# EAGLE schematic breakout (EAGLE 8.4.1)
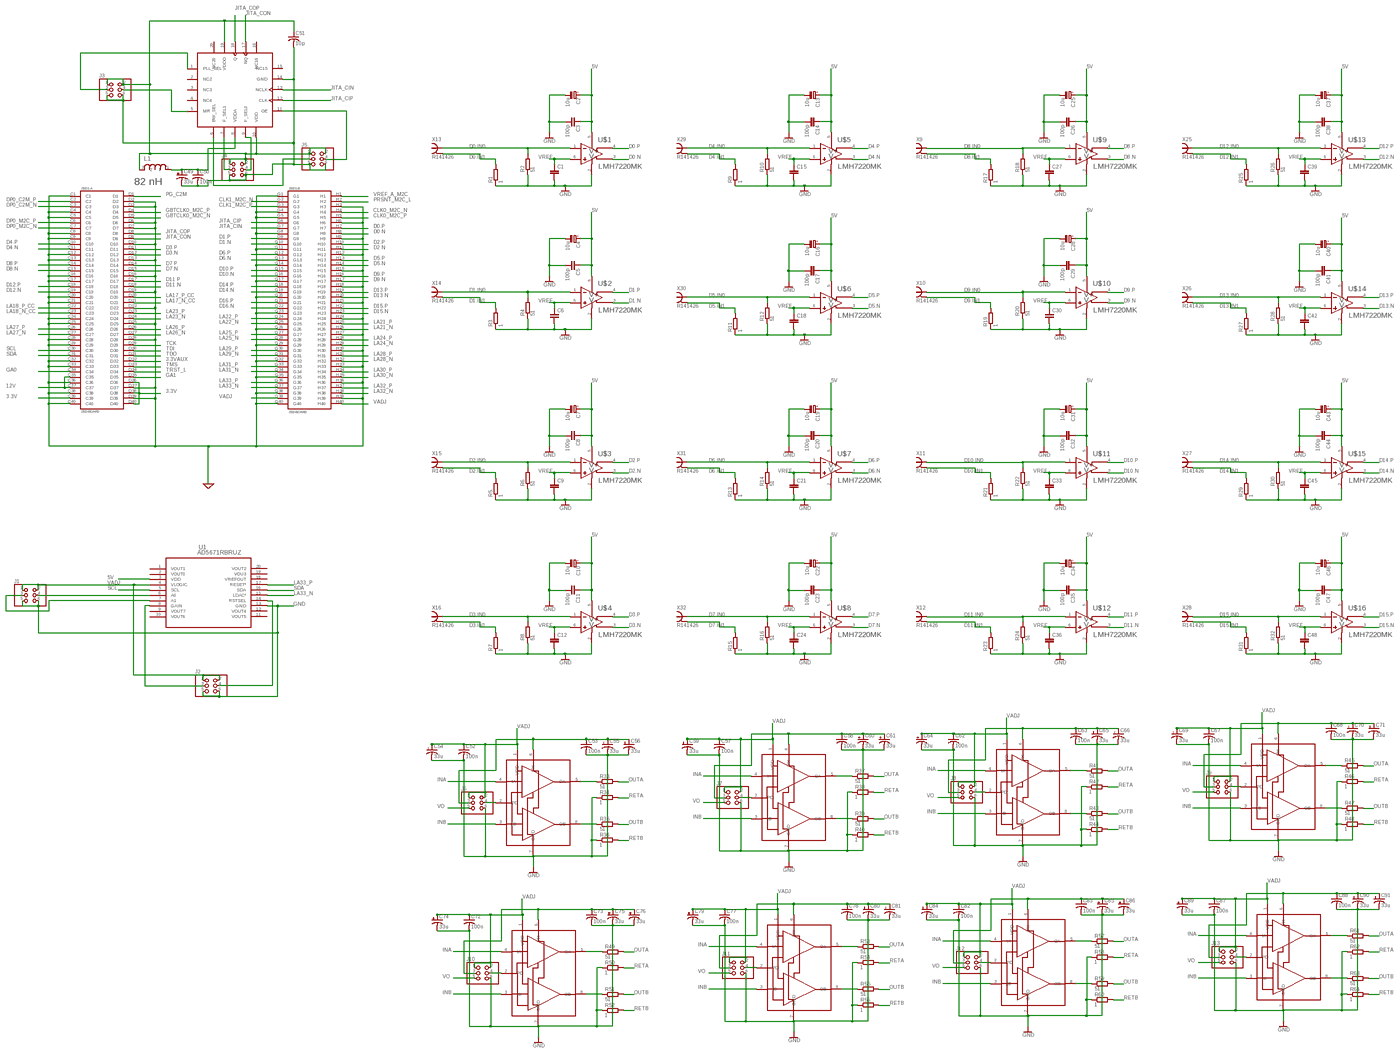
[diagram p0: schematic, sheet 1, overview]
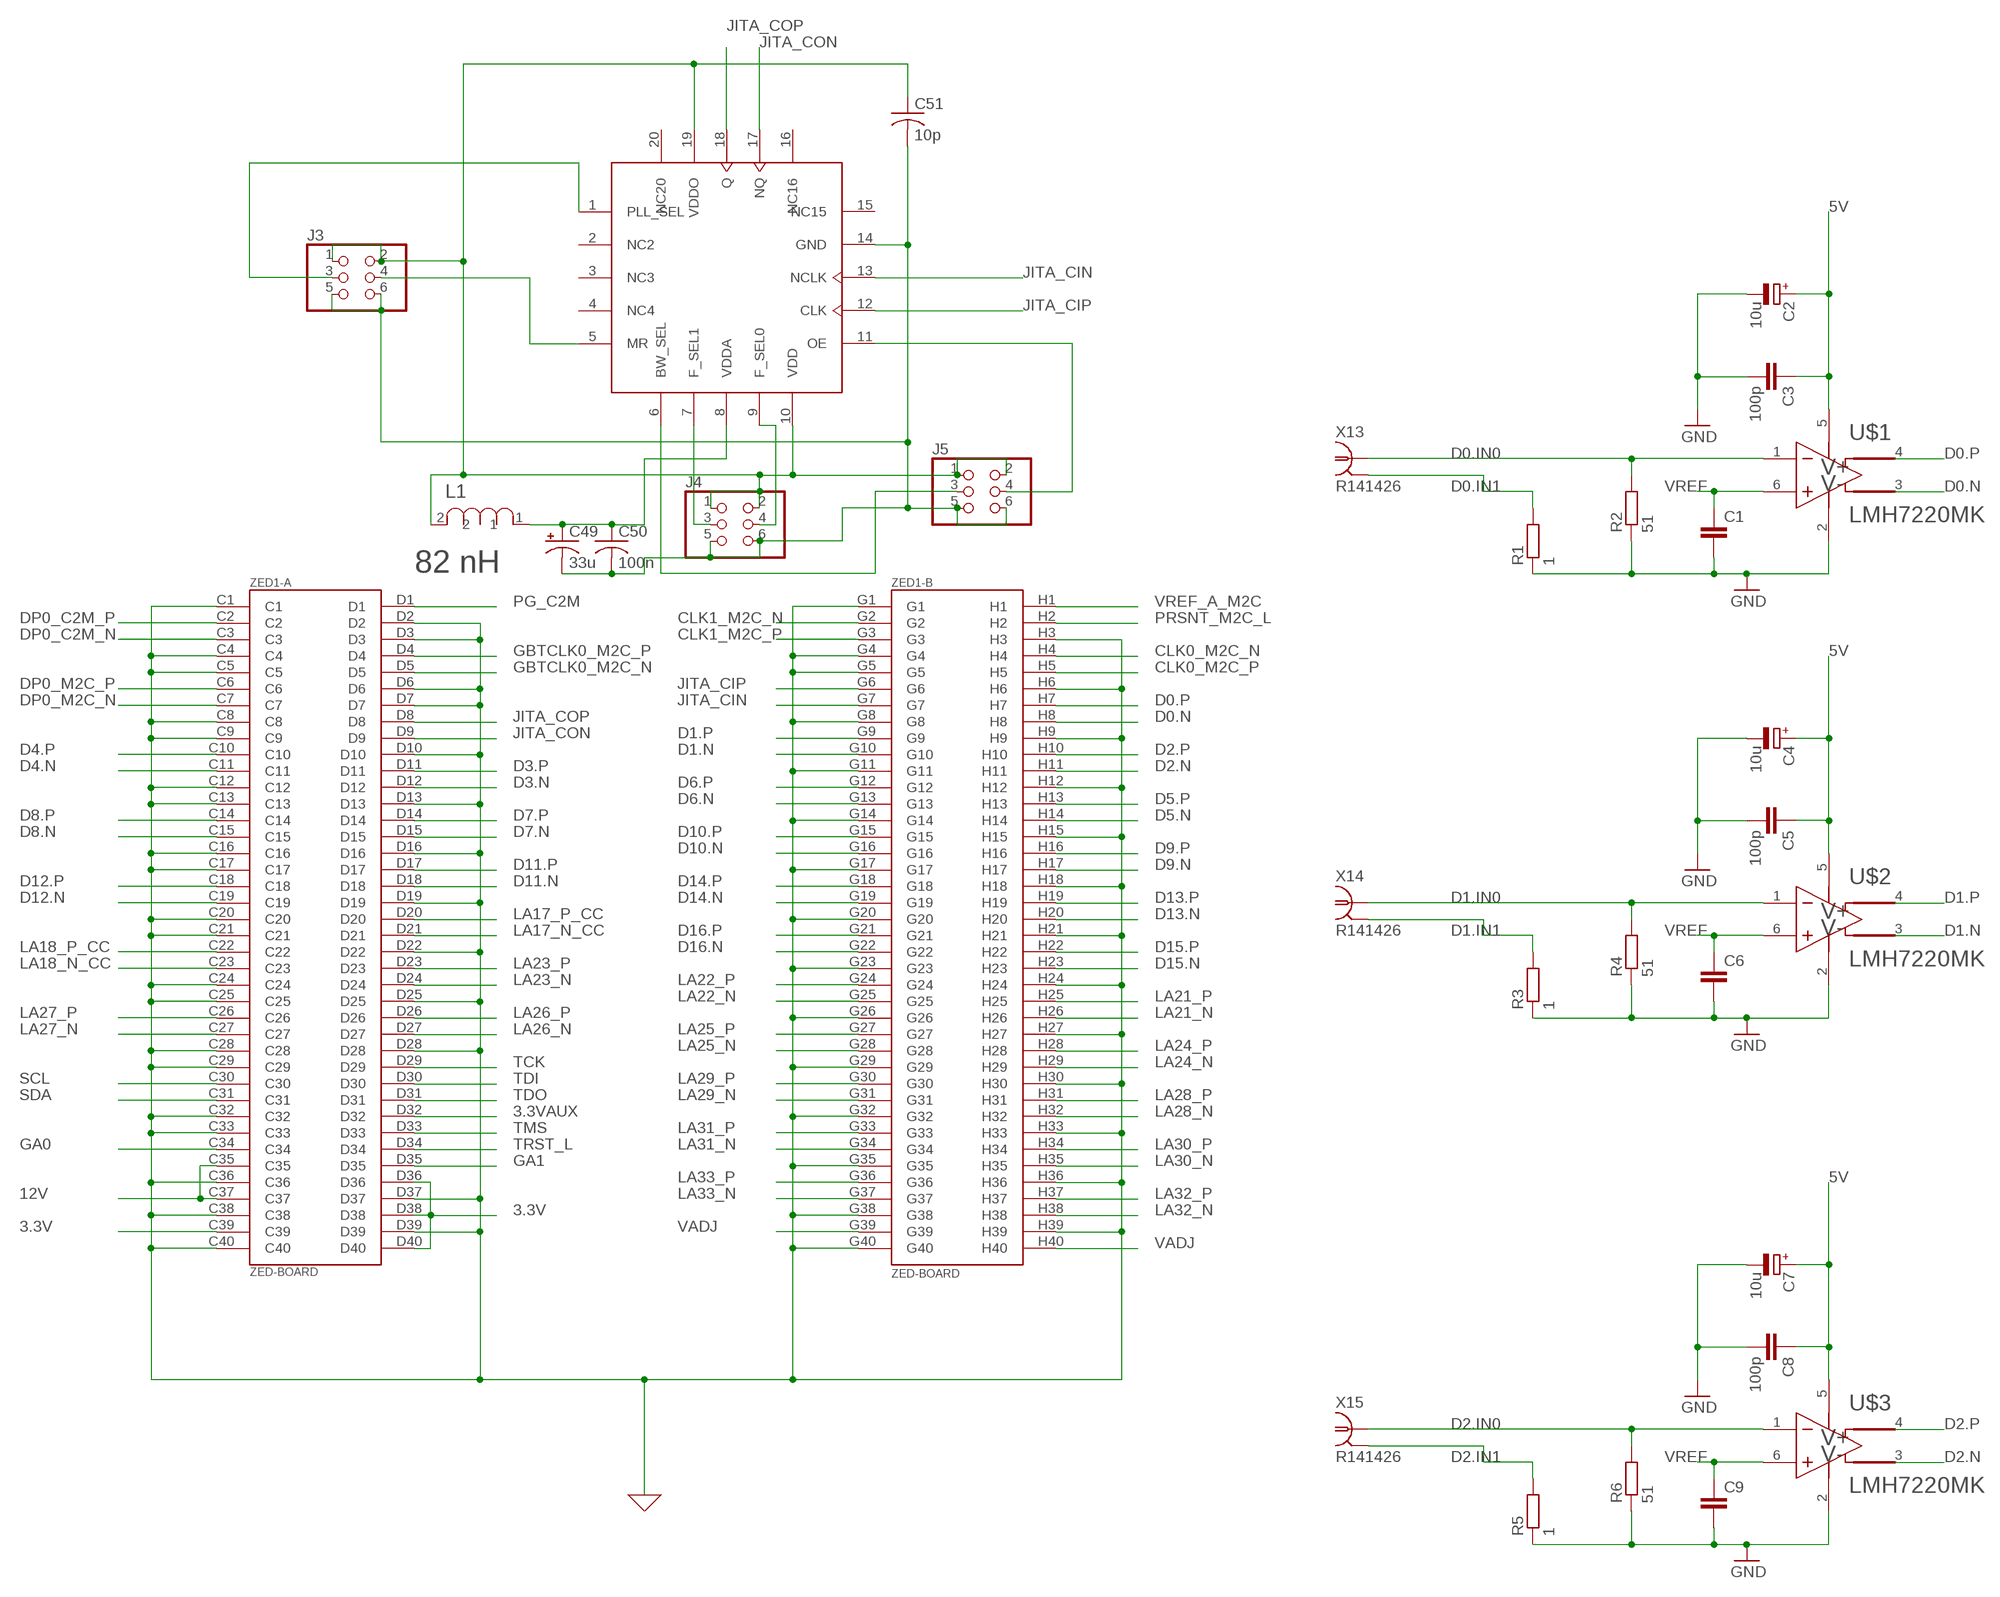
[diagram p1: schematic, sheet 1, part 1 of 4]
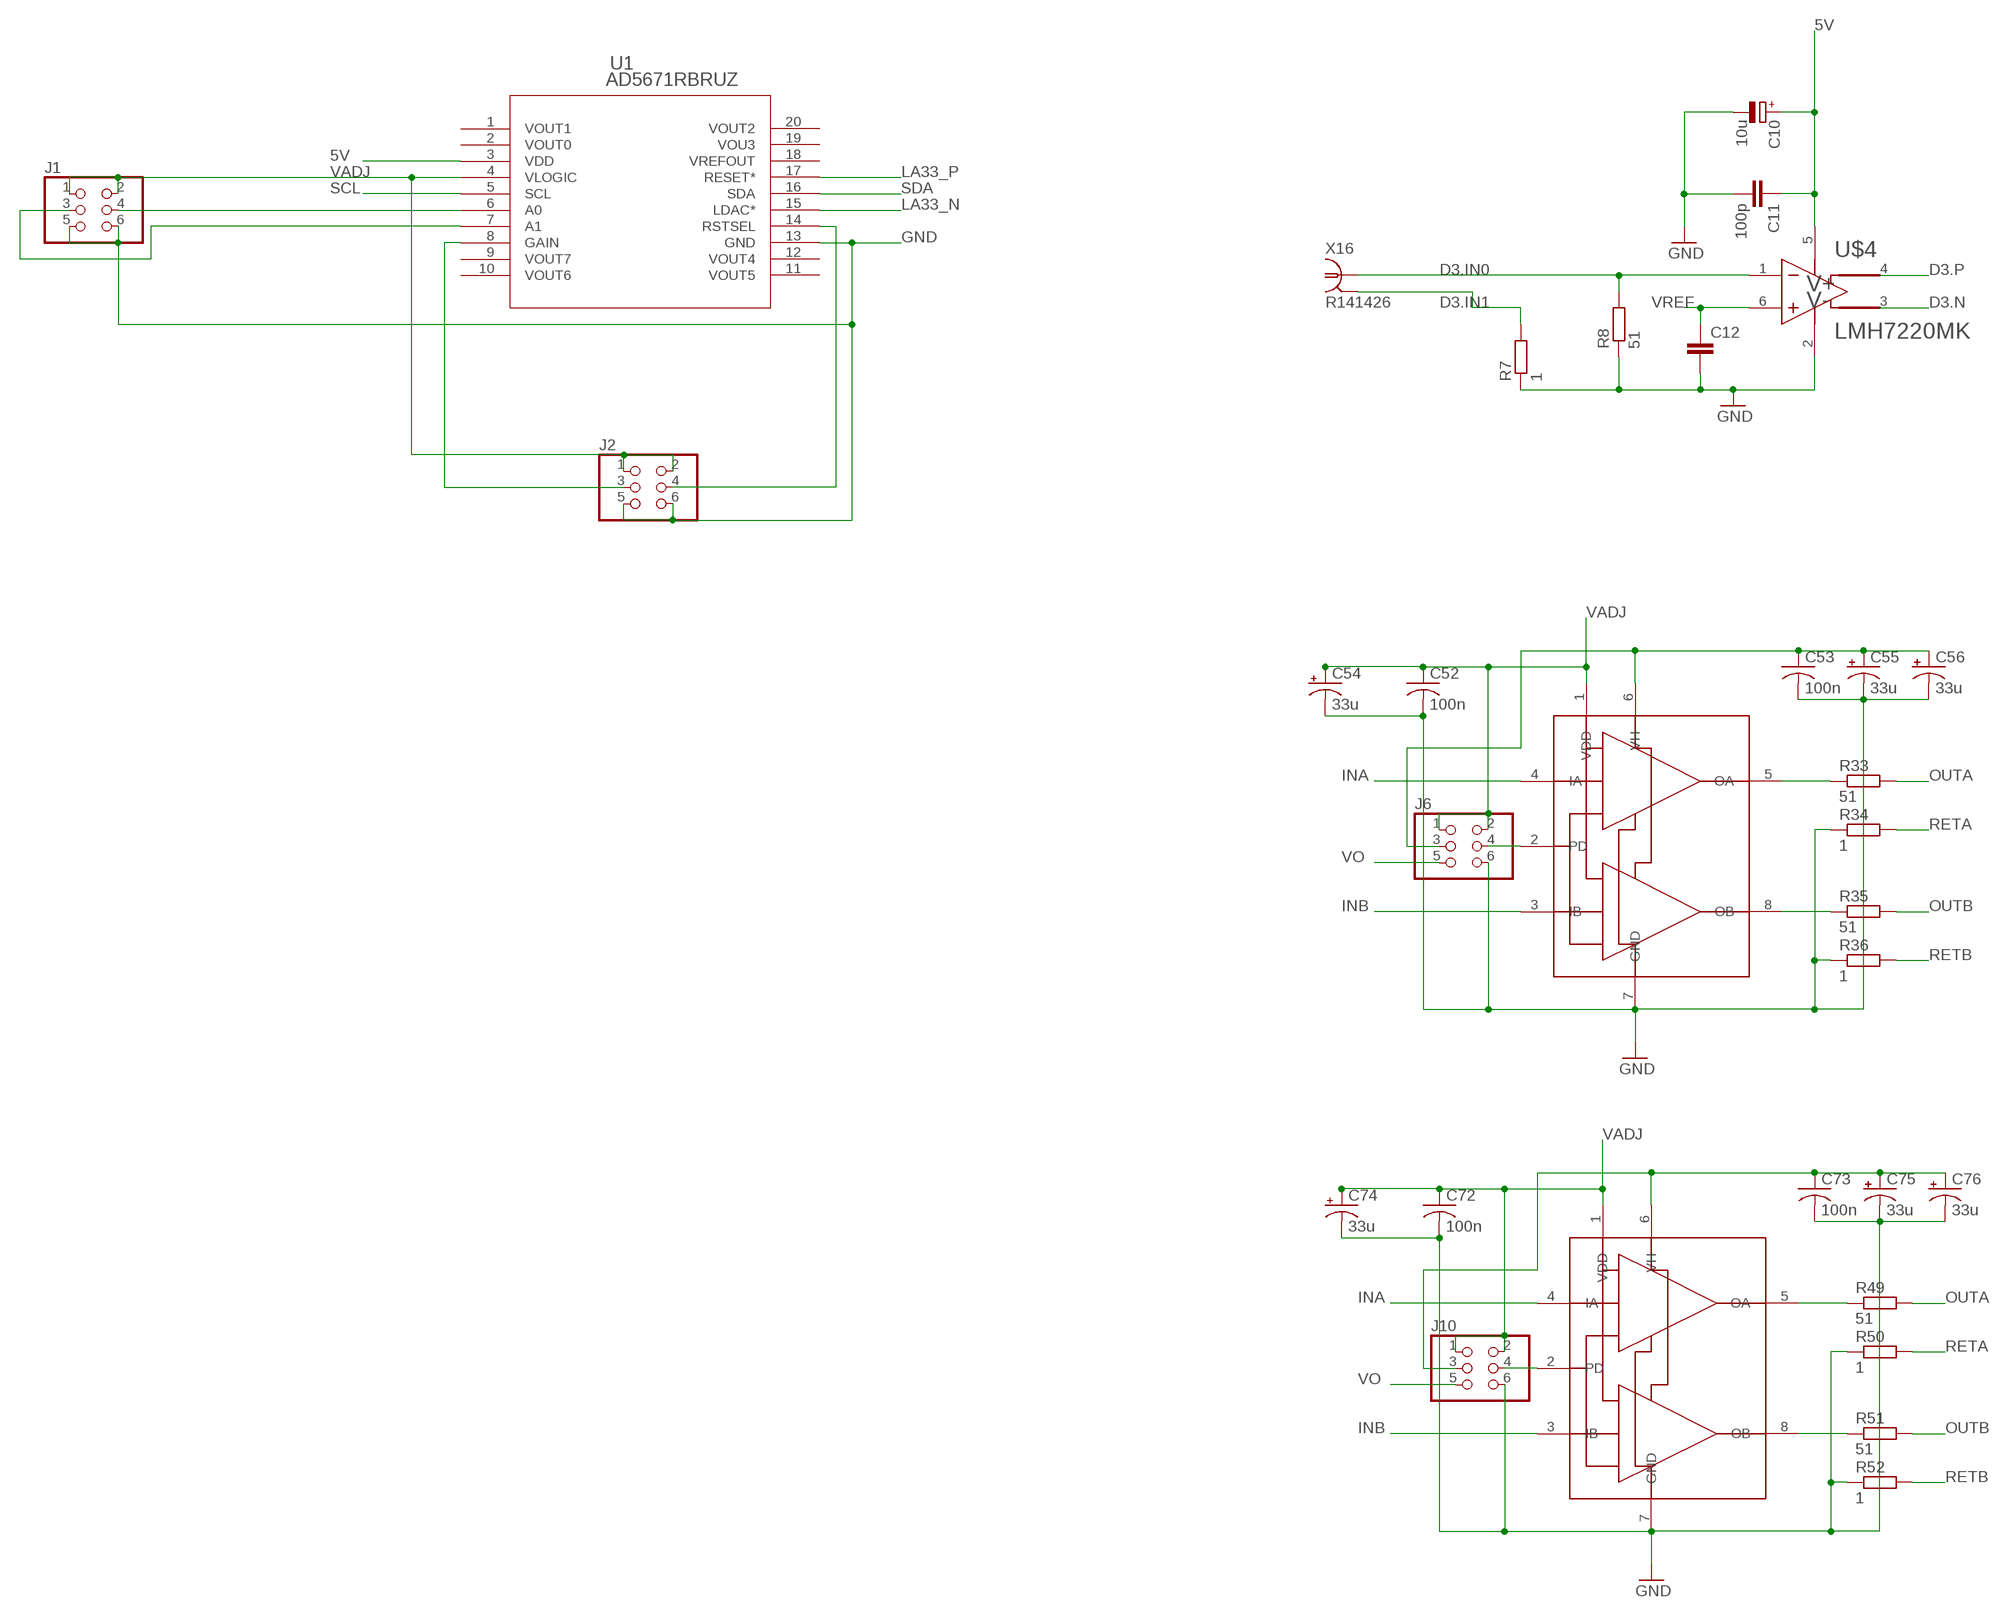
[diagram p2: schematic, sheet 1, part 2 of 4]
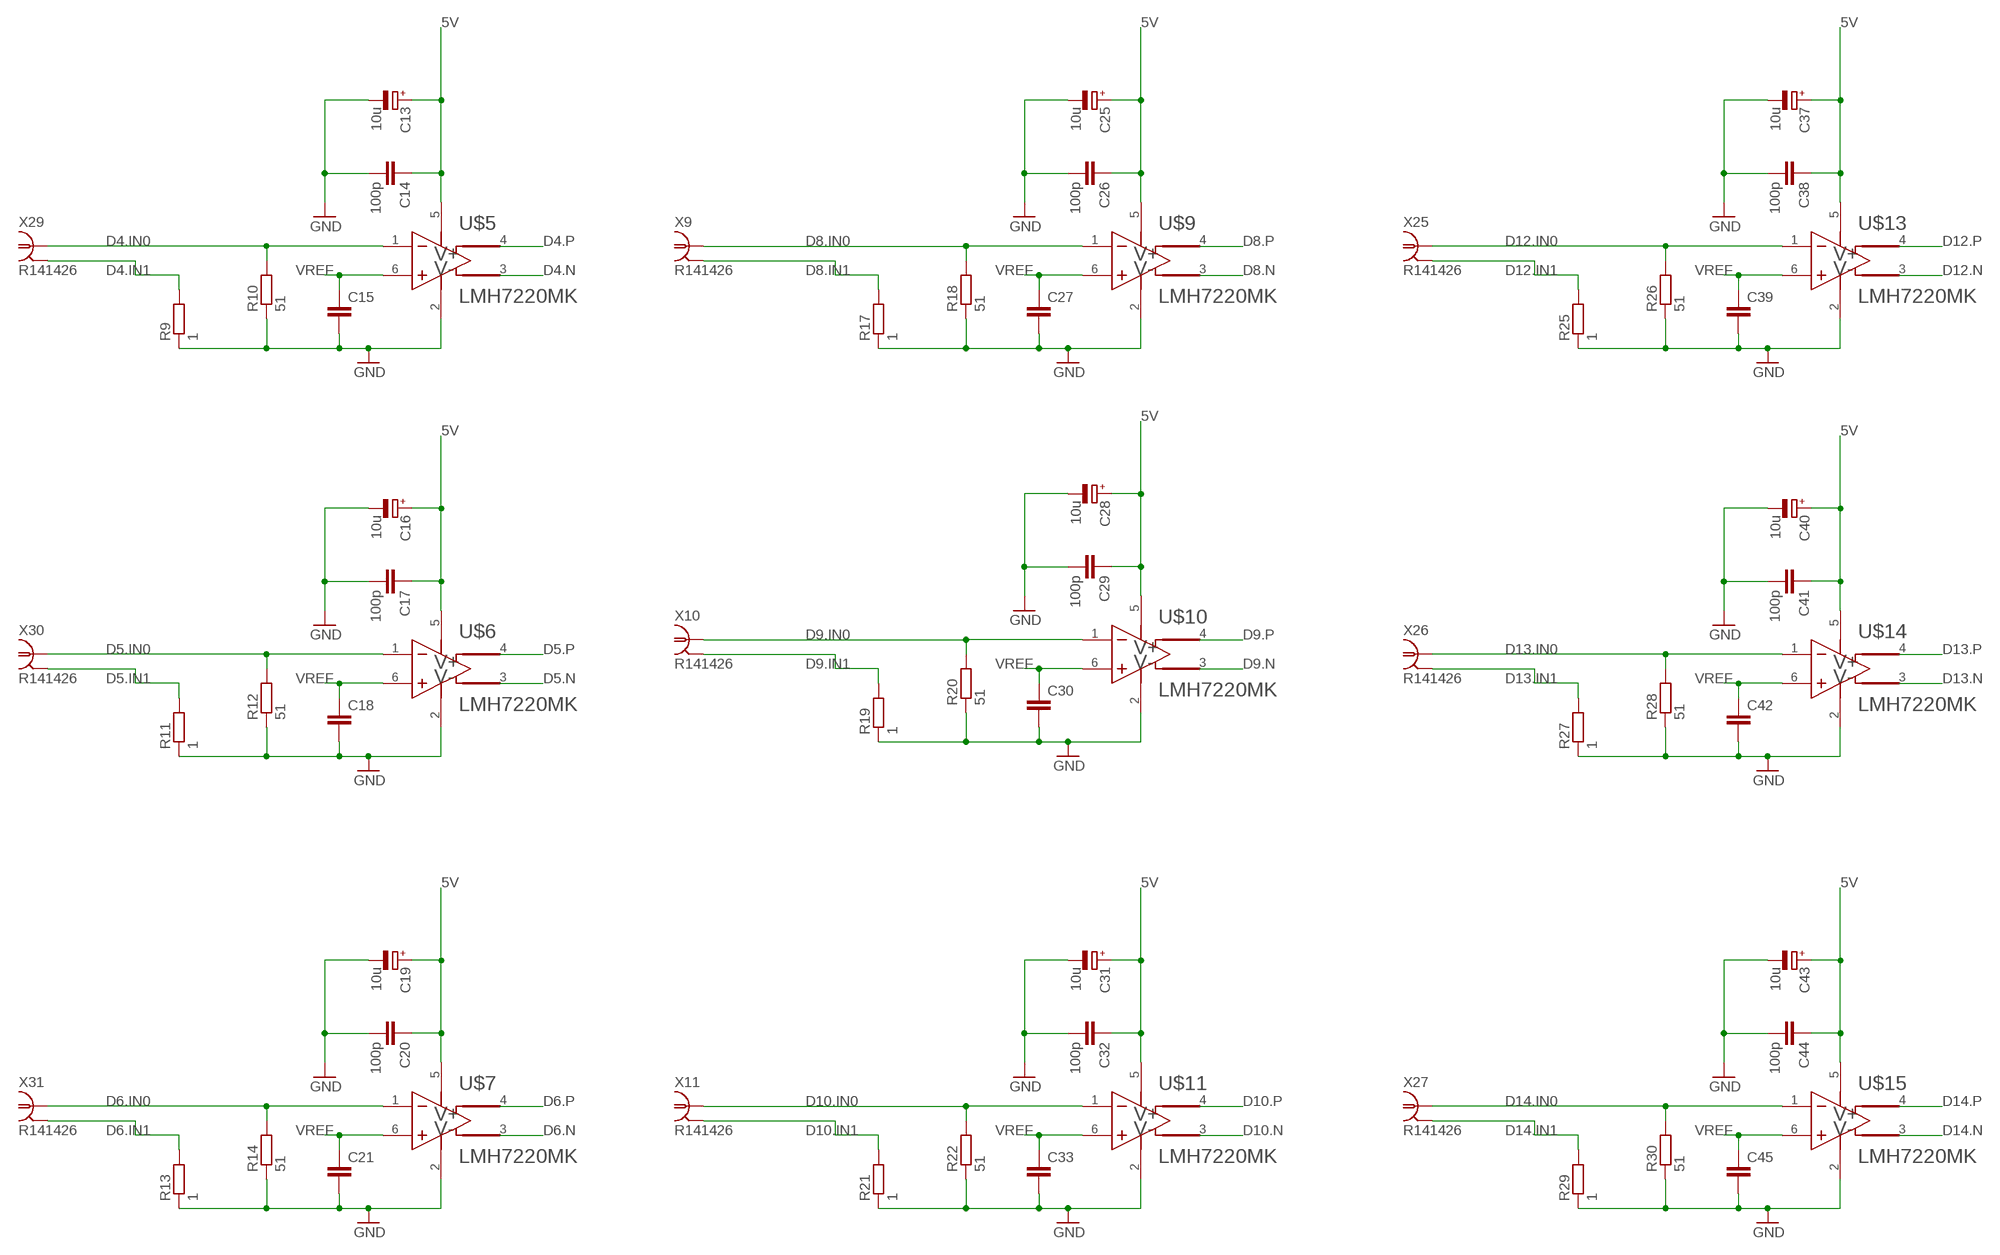
[diagram p3: schematic, sheet 1, part 3 of 4]
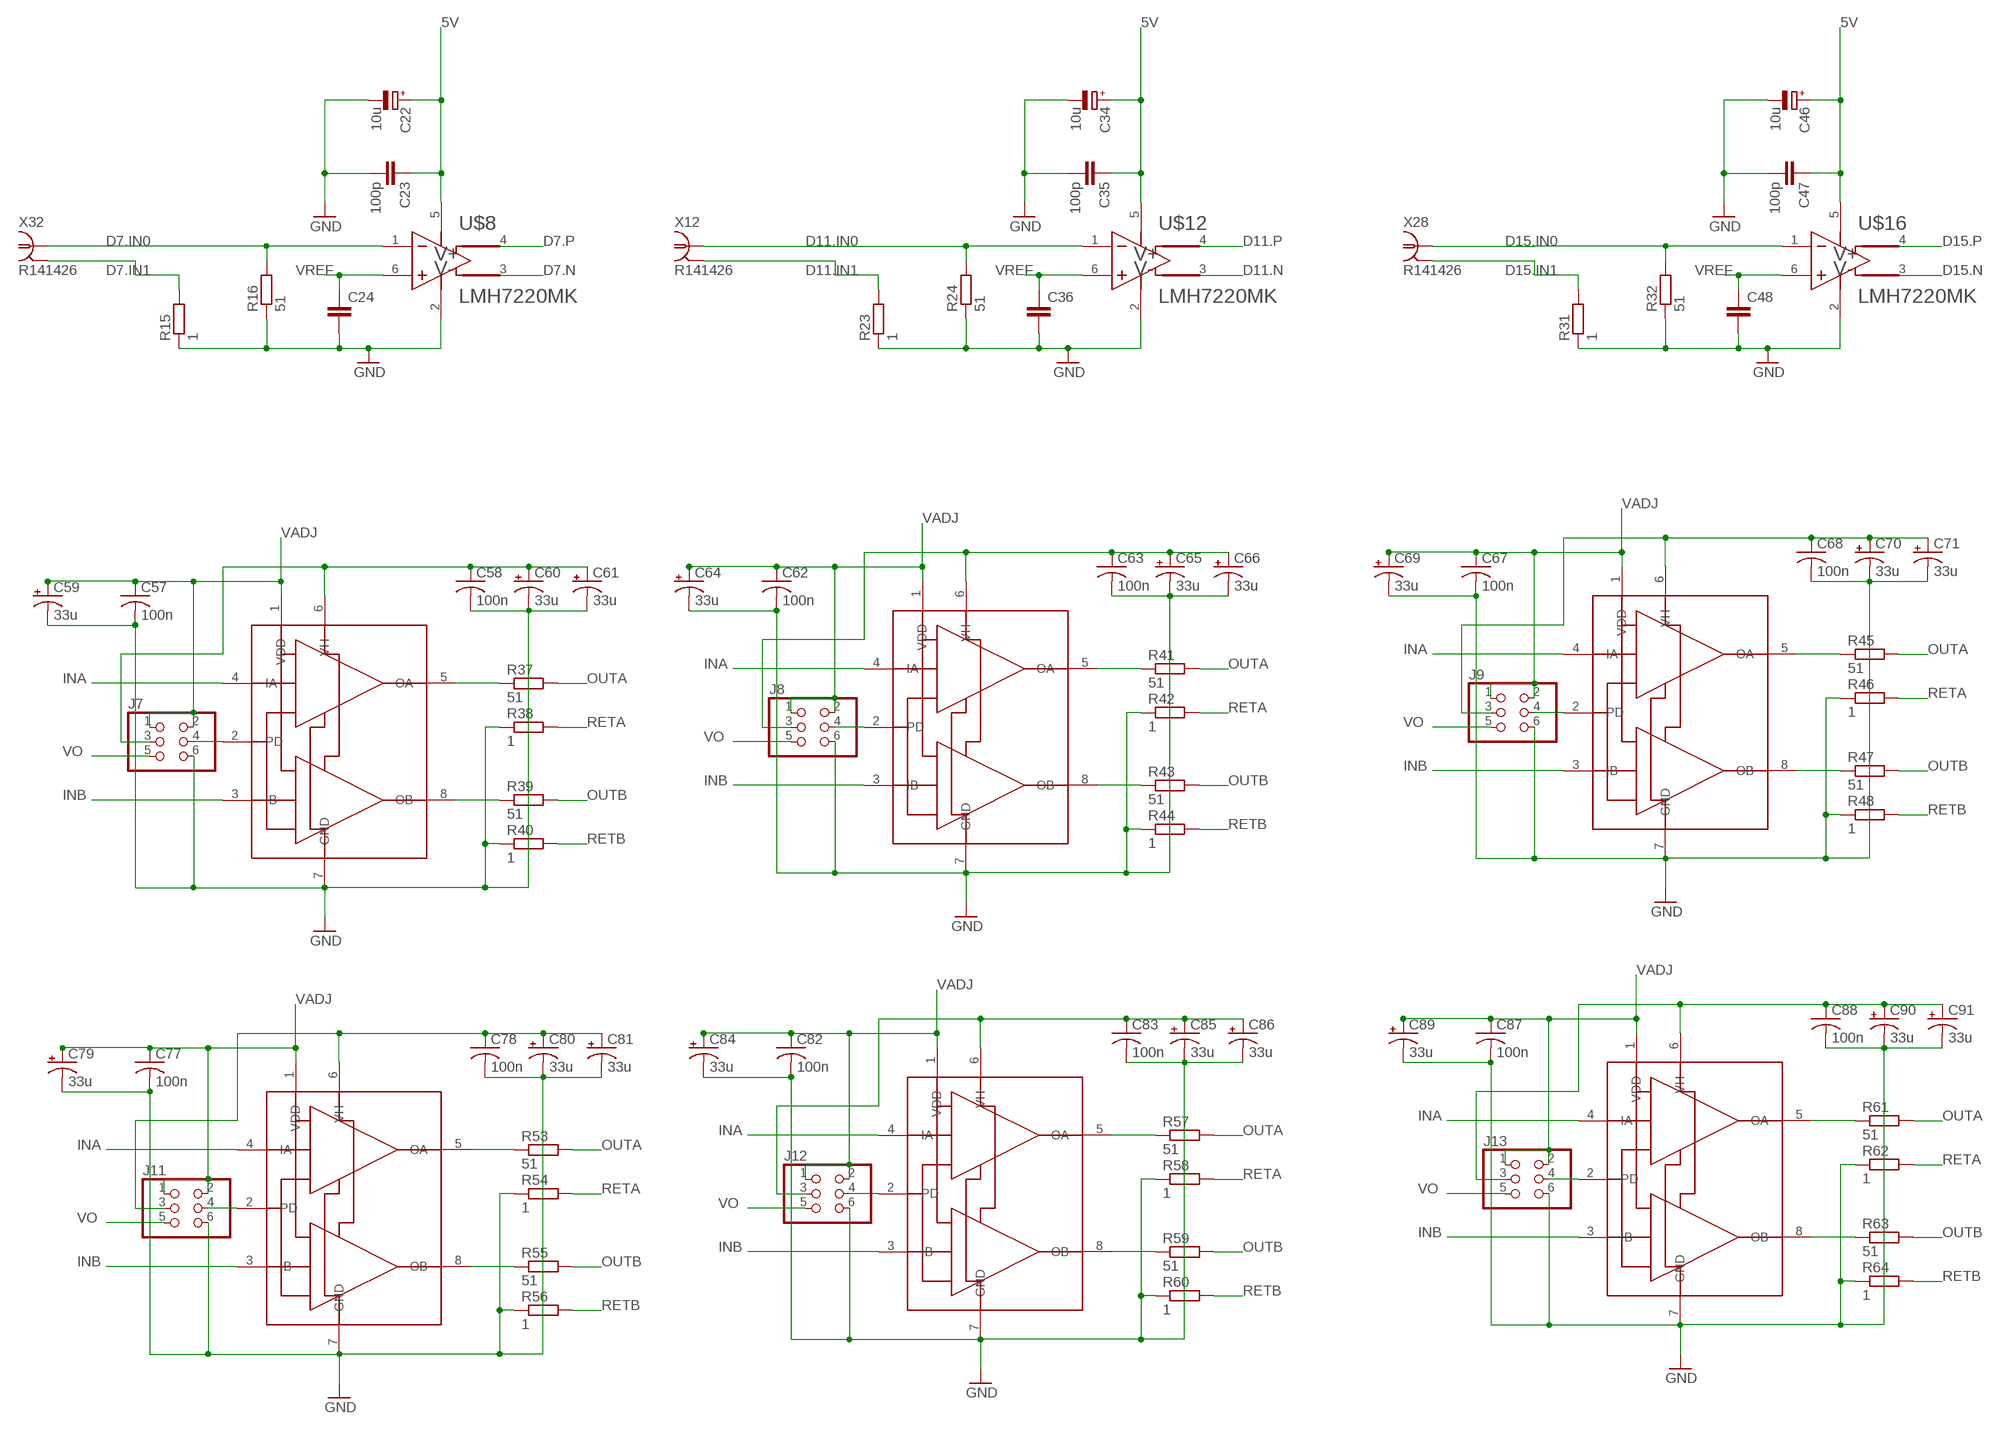
[diagram p4: schematic, sheet 1, part 4 of 4]

## Parts
C1  C-EUC2012  [C2012]
C2  10u  CPOL-EUCT3528  [CT3528]
C3  100p  C-EUC2012  [C2012]
C4  10u  CPOL-EUCT3528  [CT3528]
C5  100p  C-EUC2012  [C2012]
C6  C-EUC2012  [C2012]
C7  10u  CPOL-EUCT3528  [CT3528]
C8  100p  C-EUC2012  [C2012]
C9  C-EUC2012  [C2012]
C10  10u  CPOL-EUCT3528  [CT3528]
C11  100p  C-EUC2012  [C2012]
C12  C-EUC2012  [C2012]
C13  10u  CPOL-EUCT3528  [CT3528]
C14  100p  C-EUC2012  [C2012]
C15  C-EUC2012  [C2012]
C16  10u  CPOL-EUCT3528  [CT3528]
C17  100p  C-EUC2012  [C2012]
C18  C-EUC2012  [C2012]
C19  10u  CPOL-EUCT3528  [CT3528]
C20  100p  C-EUC2012  [C2012]
C21  C-EUC2012  [C2012]
C22  10u  CPOL-EUCT3528  [CT3528]
C23  100p  C-EUC2012  [C2012]
C24  C-EUC2012  [C2012]
C25  10u  CPOL-EUCT3528  [CT3528]
C26  100p  C-EUC2012  [C2012]
C27  C-EUC2012  [C2012]
C28  10u  CPOL-EUCT3528  [CT3528]
C29  100p  C-EUC2012  [C2012]
C30  C-EUC2012  [C2012]
C31  10u  CPOL-EUCT3528  [CT3528]
C32  100p  C-EUC2012  [C2012]
C33  C-EUC2012  [C2012]
C34  10u  CPOL-EUCT3528  [CT3528]
C35  100p  C-EUC2012  [C2012]
C36  C-EUC2012  [C2012]
C37  10u  CPOL-EUCT3528  [CT3528]
C38  100p  C-EUC2012  [C2012]
C39  C-EUC2012  [C2012]
C40  10u  CPOL-EUCT3528  [CT3528]
C41  100p  C-EUC2012  [C2012]
C42  C-EUC2012  [C2012]
C43  10u  CPOL-EUCT3528  [CT3528]
C44  100p  C-EUC2012  [C2012]
C45  C-EUC2012  [C2012]
C46  10u  CPOL-EUCT3528  [CT3528]
C47  100p  C-EUC2012  [C2012]
C48  C-EUC2012  [C2012]
C49  33u  CPOL-USB/3528-21R  [B/3528-21R]
C50  100n  C-USC2012  [C2012]
C51  10p  C-USC2012  [C2012]
C52  100n  C-USC2012  [C2012]
C53  100n  C-USC2012  [C2012]
C54  33u  CPOL-USB/3528-21R  [B/3528-21R]
C55  33u  CPOL-USB/3528-21R  [B/3528-21R]
C56  33u  CPOL-USB/3528-21R  [B/3528-21R]
C57  100n  C-USC2012  [C2012]
C58  100n  C-USC2012  [C2012]
C59  33u  CPOL-USB/3528-21R  [B/3528-21R]
C60  33u  CPOL-USB/3528-21R  [B/3528-21R]
C61  33u  CPOL-USB/3528-21R  [B/3528-21R]
C62  100n  C-USC2012  [C2012]
C63  100n  C-USC2012  [C2012]
C64  33u  CPOL-USB/3528-21R  [B/3528-21R]
C65  33u  CPOL-USB/3528-21R  [B/3528-21R]
C66  33u  CPOL-USB/3528-21R  [B/3528-21R]
C67  100n  C-USC2012  [C2012]
C68  100n  C-USC2012  [C2012]
C69  33u  CPOL-USB/3528-21R  [B/3528-21R]
C70  33u  CPOL-USB/3528-21R  [B/3528-21R]
C71  33u  CPOL-USB/3528-21R  [B/3528-21R]
C72  100n  C-USC2012  [C2012]
C73  100n  C-USC2012  [C2012]
C74  33u  CPOL-USB/3528-21R  [B/3528-21R]
C75  33u  CPOL-USB/3528-21R  [B/3528-21R]
C76  33u  CPOL-USB/3528-21R  [B/3528-21R]
C77  100n  C-USC2012  [C2012]
C78  100n  C-USC2012  [C2012]
C79  33u  CPOL-USB/3528-21R  [B/3528-21R]
C80  33u  CPOL-USB/3528-21R  [B/3528-21R]
C81  33u  CPOL-USB/3528-21R  [B/3528-21R]
C82  100n  C-USC2012  [C2012]
C83  100n  C-USC2012  [C2012]
C84  33u  CPOL-USB/3528-21R  [B/3528-21R]
C85  33u  CPOL-USB/3528-21R  [B/3528-21R]
C86  33u  CPOL-USB/3528-21R  [B/3528-21R]
C87  100n  C-USC2012  [C2012]
C88  100n  C-USC2012  [C2012]
C89  33u  CPOL-USB/3528-21R  [B/3528-21R]
C90  33u  CPOL-USB/3528-21R  [B/3528-21R]
C91  33u  CPOL-USB/3528-21R  [B/3528-21R]
J1  PINHD-2X3  [2X03]
J2  PINHD-2X3  [2X03]
J3  PINHD-2X3  [2X03]
J4  PINHD-2X3  [2X03]
J5  PINHD-2X3  [2X03]
J6  PINHD-2X3  [2X03]
J7  PINHD-2X3  [2X03]
J8  PINHD-2X3  [2X03]
J9  PINHD-2X3  [2X03]
J10  PINHD-2X3  [2X03]
J11  PINHD-2X3  [2X03]
J12  PINHD-2X3  [2X03]
J13  PINHD-2X3  [2X03]
L1  82 nH  CI160808-82NJ  [INDC1608X08N]
R1  1  R-EU_R0805  [R0805]
R2  51  R-EU_R0805  [R0805]
R3  1  R-EU_R0805  [R0805]
R4  51  R-EU_R0805  [R0805]
R5  1  R-EU_R0805  [R0805]
R6  51  R-EU_R0805  [R0805]
R7  1  R-EU_R0805  [R0805]
R8  51  R-EU_R0805  [R0805]
R9  1  R-EU_R0805  [R0805]
R10  51  R-EU_R0805  [R0805]
R11  1  R-EU_R0805  [R0805]
R12  51  R-EU_R0805  [R0805]
R13  1  R-EU_R0805  [R0805]
R14  51  R-EU_R0805  [R0805]
R15  1  R-EU_R0805  [R0805]
R16  51  R-EU_R0805  [R0805]
R17  1  R-EU_R0805  [R0805]
R18  51  R-EU_R0805  [R0805]
R19  1  R-EU_R0805  [R0805]
R20  51  R-EU_R0805  [R0805]
R21  1  R-EU_R0805  [R0805]
R22  51  R-EU_R0805  [R0805]
R23  1  R-EU_R0805  [R0805]
R24  51  R-EU_R0805  [R0805]
R25  1  R-EU_R0805  [R0805]
R26  51  R-EU_R0805  [R0805]
R27  1  R-EU_R0805  [R0805]
R28  51  R-EU_R0805  [R0805]
R29  1  R-EU_R0805  [R0805]
R30  51  R-EU_R0805  [R0805]
R31  1  R-EU_R0805  [R0805]
R32  51  R-EU_R0805  [R0805]
R33  51  R-EU_R0805  [R0805]
R34  1  R-EU_R0805  [R0805]
R35  51  R-EU_R0805  [R0805]
R36  1  R-EU_R0805  [R0805]
R37  51  R-EU_R0805  [R0805]
R38  1  R-EU_R0805  [R0805]
R39  51  R-EU_R0805  [R0805]
R40  1  R-EU_R0805  [R0805]
R41  51  R-EU_R0805  [R0805]
R42  1  R-EU_R0805  [R0805]
R43  51  R-EU_R0805  [R0805]
R44  1  R-EU_R0805  [R0805]
R45  51  R-EU_R0805  [R0805]
R46  1  R-EU_R0805  [R0805]
R47  51  R-EU_R0805  [R0805]
R48  1  R-EU_R0805  [R0805]
R49  51  R-EU_R0805  [R0805]
R50  1  R-EU_R0805  [R0805]
R51  51  R-EU_R0805  [R0805]
R52  1  R-EU_R0805  [R0805]
R53  51  R-EU_R0805  [R0805]
R54  1  R-EU_R0805  [R0805]
R55  51  R-EU_R0805  [R0805]
R56  1  R-EU_R0805  [R0805]
R57  51  R-EU_R0805  [R0805]
R58  1  R-EU_R0805  [R0805]
R59  51  R-EU_R0805  [R0805]
R60  1  R-EU_R0805  [R0805]
R61  51  R-EU_R0805  [R0805]
R62  1  R-EU_R0805  [R0805]
R63  51  R-EU_R0805  [R0805]
R64  1  R-EU_R0805  [R0805]
U1  AD5671RBRUZ  [RU_20]
U$1  LMH7220MK  [TSOP-6.PAC]
U$2  LMH7220MK  [TSOP-6.PAC]
U$3  LMH7220MK  [TSOP-6.PAC]
U$4  LMH7220MK  [TSOP-6.PAC]
U$5  LMH7220MK  [TSOP-6.PAC]
U$6  LMH7220MK  [TSOP-6.PAC]
U$7  LMH7220MK  [TSOP-6.PAC]
U$8  LMH7220MK  [TSOP-6.PAC]
U$9  LMH7220MK  [TSOP-6.PAC]
U$10  LMH7220MK  [TSOP-6.PAC]
U$11  LMH7220MK  [TSOP-6.PAC]
U$12  LMH7220MK  [TSOP-6.PAC]
U$13  LMH7220MK  [TSOP-6.PAC]
U$14  LMH7220MK  [TSOP-6.PAC]
U$15  LMH7220MK  [TSOP-6.PAC]
U$16  LMH7220MK  [TSOP-6.PAC]
U$17  ICS874001I-02  [TSSOP20]
U$18  ISL55110  [TSSOP8]
U$19  ISL55110  [TSSOP8]
U$20  ISL55110  [TSSOP8]
U$21  ISL55110  [TSSOP8]
U$22  ISL55110  [TSSOP8]
U$23  ISL55110  [TSSOP8]
U$24  ISL55110  [TSSOP8]
U$25  ISL55110  [TSSOP8]
X9  R141426  [R141426]
X10  R141426  [R141426]
X11  R141426  [R141426]
X12  R141426  [R141426]
X13  R141426  [R141426]
X14  R141426  [R141426]
X15  R141426  [R141426]
X16  R141426  [R141426]
X25  R141426  [R141426]
X26  R141426  [R141426]
X27  R141426  [R141426]
X28  R141426  [R141426]
X29  R141426  [R141426]
X30  R141426  [R141426]
X31  R141426  [R141426]
X32  R141426  [R141426]
ZED1  ZED-BOARD  [ASP-134604-01]

## Nets
0: ZED1.C1(-A:C1) ZED1.C4(-A:C4) ZED1.C5(-A:C5) ZED1.C8(-A:C8) ZED1.C9(-A:C9) ZED1.C12(-A:C12) ZED1.C13(-A:C13) ZED1.C16(-A:C16) ZED1.C17(-A:C17) ZED1.C20(-A:C20) ZED1.C21(-A:C21) ZED1.C24(-A:C24) ZED1.C25(-A:C25) ZED1.C28(-A:C28) ZED1.C29(-A:C29) ZED1.C32(-A:C32) ZED1.C33(-A:C33) ZED1.C36(-A:C36) ZED1.C38(-A:C38) ZED1.C40(-A:C40) ZED1.D2(-A:D2) ZED1.D3(-A:D3) ZED1.D6(-A:D6) ZED1.D7(-A:D7) ZED1.D10(-A:D10) ZED1.D13(-A:D13) ZED1.D16(-A:D16) ZED1.D19(-A:D19) ZED1.D22(-A:D22) ZED1.D25(-A:D25) ZED1.D28(-A:D28) ZED1.D37(-A:D37) ZED1.D39(-A:D39) ZED1.G1(-B:G1) ZED1.G4(-B:G4) ZED1.G5(-B:G5) ZED1.G8(-B:G8) ZED1.G11(-B:G11) ZED1.G14(-B:G14) ZED1.G17(-B:G17) ZED1.G20(-B:G20) ZED1.G23(-B:G23) ZED1.G26(-B:G26) ZED1.G29(-B:G29) ZED1.G32(-B:G32) ZED1.G35(-B:G35) ZED1.G38(-B:G38) ZED1.G40(-B:G40) ZED1.H3(-B:H3) ZED1.H6(-B:H6) ZED1.H9(-B:H9) ZED1.H12(-B:H12) ZED1.H15(-B:H15) ZED1.H18(-B:H18) ZED1.H21(-B:H21) ZED1.H24(-B:H24) ZED1.H27(-B:H27) ZED1.H30(-B:H30) ZED1.H33(-B:H33) ZED1.H36(-B:H36) ZED1.H39(-B:H39) ; supply symbol labelled GND
3.3V: ZED1.C39(-A:C39) ZED1.D36(-A:D36) ZED1.D38(-A:D38) ZED1.D40(-A:D40)
3.3VAUX: ZED1.D32(-A:D32)
5V: C2.+ C3.1 C4.+ C5.1 C7.+ C8.1 C10.+ C11.1 C13.+ C14.1 C16.+ C17.1 C19.+ C20.1 C22.+ C23.1 C25.+ C26.1 C28.+ C29.1 C31.+ C32.1 C34.+ C35.1 C37.+ C38.1 C40.+ C41.1 C43.+ C44.1 C46.+ C47.1 U1.3(VDD) U$1.5(V+) U$2.5(V+) U$3.5(V+) U$4.5(V+) U$5.5(V+) U$6.5(V+) U$7.5(V+) U$8.5(V+) U$9.5(V+) U$10.5(V+) U$11.5(V+) U$12.5(V+) U$13.5(V+) U$14.5(V+) U$15.5(V+) U$16.5(V+)
12V: ZED1.C35(-A:C35) ZED1.C37(-A:C37)
CLK0_M2C_N: ZED1.H4(-B:H4)
CLK0_M2C_P: ZED1.H5(-B:H5)
CLK1_M2C_N: ZED1.G2(-B:G2)
CLK1_M2C_P: ZED1.G3(-B:G3)
D0.IN0: R2.2 U$1.1(-IN) X13.1
D0.IN1: R1.2 X13.2 X13.3 X13.4 X13.5
D0.N: U$1.3(-OUT) ZED1.H8(-B:H8)
D0.P: U$1.4(+OUT) ZED1.H7(-B:H7)
D1.IN0: R4.2 U$2.1(-IN) X14.1
D1.IN1: R3.2 X14.2 X14.3 X14.4 X14.5
D1.N: U$2.3(-OUT) ZED1.G10(-B:G10)
D1.P: U$2.4(+OUT) ZED1.G9(-B:G9)
D2.IN0: R6.2 U$3.1(-IN) X15.1
D2.IN1: R5.2 X15.2 X15.3 X15.4 X15.5
D2.N: U$3.3(-OUT) ZED1.H11(-B:H11)
D2.P: U$3.4(+OUT) ZED1.H10(-B:H10)
D3.IN0: R8.2 U$4.1(-IN) X16.1
D3.IN1: R7.2 X16.2 X16.3 X16.4 X16.5
D3.N: U$4.3(-OUT) ZED1.D12(-A:D12)
D3.P: U$4.4(+OUT) ZED1.D11(-A:D11)
D4.IN0: R10.2 U$5.1(-IN) X29.1
D4.IN1: R9.2 X29.2 X29.3 X29.4 X29.5
D4.N: U$5.3(-OUT) ZED1.C11(-A:C11)
D4.P: U$5.4(+OUT) ZED1.C10(-A:C10)
D5.IN0: R12.2 U$6.1(-IN) X30.1
D5.IN1: R11.2 X30.2 X30.3 X30.4 X30.5
D5.N: U$6.3(-OUT) ZED1.H14(-B:H14)
D5.P: U$6.4(+OUT) ZED1.H13(-B:H13)
D6.IN0: R14.2 U$7.1(-IN) X31.1
D6.IN1: R13.2 X31.2 X31.3 X31.4 X31.5
D6.N: U$7.3(-OUT) ZED1.G13(-B:G13)
D6.P: U$7.4(+OUT) ZED1.G12(-B:G12)
D7.IN0: R16.2 U$8.1(-IN) X32.1
D7.IN1: R15.2 X32.2 X32.3 X32.4 X32.5
D7.N: U$8.3(-OUT) ZED1.D15(-A:D15)
D7.P: U$8.4(+OUT) ZED1.D14(-A:D14)
D8.IN0: R18.2 U$9.1(-IN) X9.1
D8.IN1: R17.2 X9.2 X9.3 X9.4 X9.5
D8.N: U$9.3(-OUT) ZED1.C15(-A:C15)
D8.P: U$9.4(+OUT) ZED1.C14(-A:C14)
D9.IN0: R20.2 U$10.1(-IN) X10.1
D9.IN1: R19.2 X10.2 X10.3 X10.4 X10.5
D9.N: U$10.3(-OUT) ZED1.H17(-B:H17)
D9.P: U$10.4(+OUT) ZED1.H16(-B:H16)
D10.IN0: R22.2 U$11.1(-IN) X11.1
D10.IN1: R21.2 X11.2 X11.3 X11.4 X11.5
D10.N: U$11.3(-OUT) ZED1.G16(-B:G16)
D10.P: U$11.4(+OUT) ZED1.G15(-B:G15)
D11.IN0: R24.2 U$12.1(-IN) X12.1
D11.IN1: R23.2 X12.2 X12.3 X12.4 X12.5
D11.N: U$12.3(-OUT) ZED1.D18(-A:D18)
D11.P: U$12.4(+OUT) ZED1.D17(-A:D17)
D12.IN0: R26.2 U$13.1(-IN) X25.1
D12.IN1: R25.2 X25.2 X25.3 X25.4 X25.5
D12.N: U$13.3(-OUT) ZED1.C19(-A:C19)
D12.P: U$13.4(+OUT) ZED1.C18(-A:C18)
D13.IN0: R28.2 U$14.1(-IN) X26.1
D13.IN1: R27.2 X26.2 X26.3 X26.4 X26.5
D13.N: U$14.3(-OUT) ZED1.H20(-B:H20)
D13.P: U$14.4(+OUT) ZED1.H19(-B:H19)
D14.IN0: R30.2 U$15.1(-IN) X27.1
D14.IN1: R29.2 X27.2 X27.3 X27.4 X27.5
D14.N: U$15.3(-OUT) ZED1.G19(-B:G19)
D14.P: U$15.4(+OUT) ZED1.G18(-B:G18)
D15.IN0: R32.2 U$16.1(-IN) X28.1
D15.IN1: R31.2 X28.2 X28.3 X28.4 X28.5
D15.N: U$16.3(-OUT) ZED1.H23(-B:H23)
D15.P: U$16.4(+OUT) ZED1.H22(-B:H22)
D16.N: ZED1.G22(-B:G22)
D16.P: ZED1.G21(-B:G21)
DP0_C2M_N: ZED1.C3(-A:C3)
DP0_C2M_P: ZED1.C2(-A:C2)
DP0_M2C_N: ZED1.C7(-A:C7)
DP0_M2C_P: ZED1.C6(-A:C6)
GA0: ZED1.C34(-A:C34)
GA1: ZED1.D35(-A:D35)
GBTCLK0_M2C_N: ZED1.D5(-A:D5)
GBTCLK0_M2C_P: ZED1.D4(-A:D4)
GND: C1.2 C2.- C3.2 C4.- C5.2 C6.2 C7.- C8.2 C9.2 C10.- C11.2 C12.2 C13.- C14.2 C15.2 C16.- C17.2 C18.2 C19.- C20.2 C21.2 C22.- C23.2 C24.2 C25.- C26.2 C27.2 C28.- C29.2 C30.2 C31.- C32.2 C33.2 C34.- C35.2 C36.2 C37.- C38.2 C39.2 C40.- C41.2 C42.2 C43.- C44.2 C45.2 C46.- C47.2 C48.2 C52.2 C53.2 C54.- C55.- C56.- C57.2 C58.2 C59.- C60.- C61.- C62.2 C63.2 C64.- C65.- C66.- C67.2 C68.2 C69.- C70.- C71.- C72.2 C73.2 C74.- C75.- C76.- C77.2 C78.2 C79.- C80.- C81.- C82.2 C83.2 C84.- C85.- C86.- C87.2 C88.2 C89.- C90.- C91.- J1.5 J1.6 J2.5 J2.6 J6.6 J7.6 J8.6 J9.6 J10.6 J11.6 J12.6 J13.6 R1.1 R2.1 R3.1 R4.1 R5.1 R6.1 R7.1 R8.1 R9.1 R10.1 R11.1 R12.1 R13.1 R14.1 R15.1 R16.1 R17.1 R18.1 R19.1 R20.1 R21.1 R22.1 R23.1 R24.1 R25.1 R26.1 R27.1 R28.1 R29.1 R30.1 R31.1 R32.1 R34.1 R36.1 R38.1 R40.1 R42.1 R44.1 R46.1 R48.1 R50.1 R52.1 R54.1 R56.1 R58.1 R60.1 R62.1 R64.1 U1.13(GND) U$1.2(V-) U$2.2(V-) U$3.2(V-) U$4.2(V-) U$5.2(V-) U$6.2(V-) U$7.2(V-) U$8.2(V-) U$9.2(V-) U$10.2(V-) U$11.2(V-) U$12.2(V-) U$13.2(V-) U$14.2(V-) U$15.2(V-) U$16.2(V-) U$18.7(GND) U$19.7(GND) U$20.7(GND) U$21.7(GND) U$22.7(GND) U$23.7(GND) U$24.7(GND) U$25.7(GND)
INA: U$18.4(IA) U$19.4(IA) U$20.4(IA) U$21.4(IA) U$22.4(IA) U$23.4(IA) U$24.4(IA) U$25.4(IA)
INB: U$18.3(IB) U$19.3(IB) U$20.3(IB) U$21.3(IB) U$22.3(IB) U$23.3(IB) U$24.3(IB) U$25.3(IB)
JITA_CIN: U$17.13(NCLK) ZED1.G7(-B:G7)
JITA_CIP: U$17.12(CLK) ZED1.G6(-B:G6)
JITA_CON: U$17.17(NQ) ZED1.D9(-A:D9)
JITA_COP: U$17.18(Q) ZED1.D8(-A:D8)
LA17_N_CC: ZED1.D21(-A:D21)
LA17_P_CC: ZED1.D20(-A:D20)
LA18_N_CC: ZED1.C23(-A:C23)
LA18_P_CC: ZED1.C22(-A:C22)
LA21_N: ZED1.H26(-B:H26)
LA21_P: ZED1.H25(-B:H25)
LA22_N: ZED1.G25(-B:G25)
LA22_P: ZED1.G24(-B:G24)
LA23_N: ZED1.D24(-A:D24)
LA23_P: ZED1.D23(-A:D23)
LA24_N: ZED1.H29(-B:H29)
LA24_P: ZED1.H28(-B:H28)
LA25_N: ZED1.G28(-B:G28)
LA25_P: ZED1.G27(-B:G27)
LA26_N: ZED1.D27(-A:D27)
LA26_P: ZED1.D26(-A:D26)
LA27_N: ZED1.C27(-A:C27)
LA27_P: ZED1.C26(-A:C26)
LA28_N: ZED1.H32(-B:H32)
LA28_P: ZED1.H31(-B:H31)
LA29_N: ZED1.G31(-B:G31)
LA29_P: ZED1.G30(-B:G30)
LA30_N: ZED1.H35(-B:H35)
LA30_P: ZED1.H34(-B:H34)
LA31_N: ZED1.G34(-B:G34)
LA31_P: ZED1.G33(-B:G33)
LA32_N: ZED1.H38(-B:H38)
LA32_P: ZED1.H37(-B:H37)
LA33_N: U1.15(LDAC*) ZED1.G37(-B:G37)
LA33_P: U1.17(RESET*) ZED1.G36(-B:G36)
N$1: J1.4 U1.6(A0)
N$2: J1.3 U1.7(A1)
N$3: J2.3 U1.8(GAIN)
N$4: J2.4 U1.14(RSTSEL)
N$5: J3.4 U$17.5(MR)
N$6: J3.3 U$17.1(PLL_SEL)
N$7: J4.3 U$17.7(F_SEL1)
N$8: J4.4 U$17.9(F_SEL0)
N$9: J5.3 U$17.6(BW_SEL)
N$10: J5.4 U$17.11(OE)
N$11: J6.4 U$18.2(PD)
N$12: C49.+ C50.1 L1.1 U$17.8(VDDA)
N$13: C51.1 J3.1 J3.2 J4.1 J4.2 J5.1 J5.2 L1.2 U$17.10(VDD) U$17.19(VDDO)
N$14: C49.- C50.2 C51.2 J3.5 J3.6 J4.5 J4.6 J5.5 J5.6 U$17.14(GND)
N$15: C53.1 C55.+ C56.+ J6.3 U$18.6(VH)
N$16: R35.1 U$18.8(OB)
N$17: R33.1 U$18.5(OA)
N$18: J7.4 U$19.2(PD)
N$19: C58.1 C60.+ C61.+ J7.3 U$19.6(VH)
N$20: R39.1 U$19.8(OB)
N$21: R37.1 U$19.5(OA)
N$22: J8.4 U$20.2(PD)
N$23: C63.1 C65.+ C66.+ J8.3 U$20.6(VH)
N$24: R43.1 U$20.8(OB)
N$25: R41.1 U$20.5(OA)
N$26: J9.4 U$21.2(PD)
N$27: C68.1 C70.+ C71.+ J9.3 U$21.6(VH)
N$28: R47.1 U$21.8(OB)
N$29: R45.1 U$21.5(OA)
N$30: J10.4 U$22.2(PD)
N$31: C73.1 C75.+ C76.+ J10.3 U$22.6(VH)
N$32: R51.1 U$22.8(OB)
N$33: R49.1 U$22.5(OA)
N$34: J11.4 U$23.2(PD)
N$35: C78.1 C80.+ C81.+ J11.3 U$23.6(VH)
N$36: R55.1 U$23.8(OB)
N$37: R53.1 U$23.5(OA)
N$38: J12.4 U$24.2(PD)
N$39: C83.1 C85.+ C86.+ J12.3 U$24.6(VH)
N$40: R59.1 U$24.8(OB)
N$41: R57.1 U$24.5(OA)
N$42: J13.4 U$25.2(PD)
N$43: C88.1 C90.+ C91.+ J13.3 U$25.6(VH)
N$44: R63.1 U$25.8(OB)
N$45: R61.1 U$25.5(OA)
OUTA: R33.2 R37.2 R41.2 R45.2 R49.2 R53.2 R57.2 R61.2
OUTB: R35.2 R39.2 R43.2 R47.2 R51.2 R55.2 R59.2 R63.2
PG_C2M: ZED1.D1(-A:D1)
PRSNT_M2C_L: ZED1.H2(-B:H2)
RETA: R34.2 R38.2 R42.2 R46.2 R50.2 R54.2 R58.2 R62.2
RETB: R36.2 R40.2 R44.2 R48.2 R52.2 R56.2 R60.2 R64.2
SCL: U1.5(SCL) ZED1.C30(-A:C30)
SDA: U1.16(SDA) ZED1.C31(-A:C31)
TCK: ZED1.D29(-A:D29)
TDI: ZED1.D30(-A:D30)
TDO: ZED1.D31(-A:D31)
TMS: ZED1.D33(-A:D33)
TRST_L: ZED1.D34(-A:D34)
VADJ: C52.1 C54.+ C57.1 C59.+ C62.1 C64.+ C67.1 C69.+ C72.1 C74.+ C77.1 C79.+ C82.1 C84.+ C87.1 C89.+ J1.1 J1.2 J2.1 J2.2 J6.1 J6.2 J7.1 J7.2 J8.1 J8.2 J9.1 J9.2 J10.1 J10.2 J11.1 J11.2 J12.1 J12.2 J13.1 J13.2 U1.4(VLOGIC) U$18.1(VDD) U$19.1(VDD) U$20.1(VDD) U$21.1(VDD) U$22.1(VDD) U$23.1(VDD) U$24.1(VDD) U$25.1(VDD) ZED1.G39(-B:G39) ZED1.H40(-B:H40)
VO: J6.5 J7.5 J8.5 J9.5 J10.5 J11.5 J12.5 J13.5
VREF: C1.1 C6.1 C9.1 C12.1 C15.1 C18.1 C21.1 C24.1 C27.1 C30.1 C33.1 C36.1 C39.1 C42.1 C45.1 C48.1 U$1.6(+IN) U$2.6(+IN) U$3.6(+IN) U$4.6(+IN) U$5.6(+IN) U$6.6(+IN) U$7.6(+IN) U$8.6(+IN) U$9.6(+IN) U$10.6(+IN) U$11.6(+IN) U$12.6(+IN) U$13.6(+IN) U$14.6(+IN) U$15.6(+IN) U$16.6(+IN)
VREF_A_M2C: ZED1.H1(-B:H1)
Unconnected: U1.1(VOUT1) U1.2(VOUT0) U1.9(VOUT7) U1.10(VOUT6) U1.11(VOUT5) U1.12(VOUT4) U1.18(VREFOUT) U1.19(VOU3) U1.20(VOUT2) U$17.2(NC2) U$17.3(NC3) U$17.4(NC4) U$17.15(NC15) U$17.16(NC16) U$17.20(NC20)

## Library data of the parts
C1 C3 C5 C6 C8 C9 C11 C12 C14 C15 C17 C18 C20 C21 C23 C24 C26 C27 C29 C30 C32 C33 C35 C36 C38 C39 C41 C42 C44 C45 C47 C48 = rcl:C-EU: CAPACITOR, European symbol
C2 C4 C7 C10 C13 C16 C19 C22 C25 C28 C31 C34 C37 C40 C43 C46 = rcl:CPOL-EU: POLARIZED CAPACITOR, European symbol
C49 = rcl:CPOL-US: POLARIZED CAPACITOR, American symbol
C50 C51 = rcl:C-US: CAPACITOR, American symbol
C52 C53 C57 C58 C62 C63 C67 C68 C72 C73 C77 C78 C82 C83 C87 C88 = adafruit:C-US: CAPACITOR, American symbol
C54-C56 C59-C61 C64-C66 C69-C71 C74-C76 C79-C81 C84-C86 C89-C91 = adafruit:CPOL-US: POLARIZED CAPACITOR, American symbol
J1-J13 = SparkFun-Retired:PINHD-2X3: PIN HEADER
L1 = Bourns_By_element14_Batch_1:CI160808-82NJ: CHIP INDUCTOR, 82NH 300MA 5% 900MHZ; MPN: CI160808-82NJ; OC_FARNELL: 4963283; OC_NEWARK: 18C0753; SUPPLIER: BOURNS; TOLERANCE: ±5 %
R1-R64 = rcl:R-EU_: RESISTOR, European symbol
U1 = AD5671R:AD5671RBRUZ
U$1-U$16 = LMH7220:LMH7220MK
U$17 = ICS874001:ICS874001I-02
U$18-U$25 = ISL55110:ISL55110
X9-X16 X25-X32 = con-coax:R141426: BNC COAX CONNECTOR Radiall 50/75 Ohm Spoerle; MF: FARNELL; MPN: R141426161; OC_FARNELL: 4195115; OC_NEWARK: 14J7919
ZED1 = zed-board:ZED-BOARD